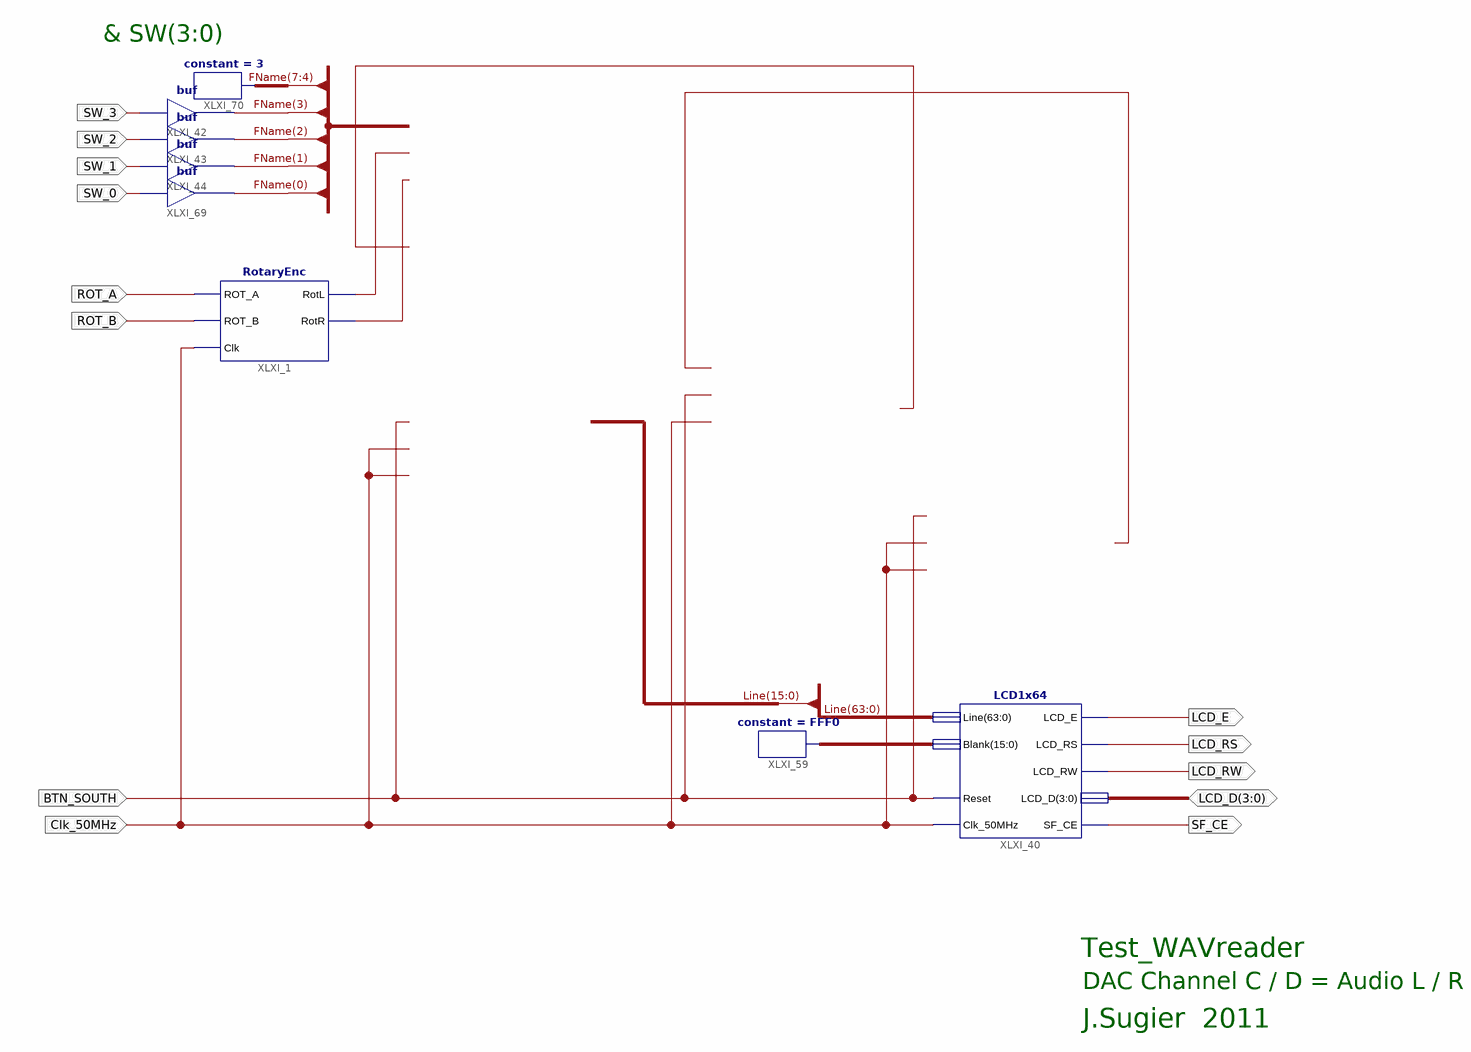
[diagram p0: schematic sheet 1]
// Xilinx ISE schematic Test_WAVreader.sch (spartan3e) as structural Verilog: 8 symbols, 13 ports
module Test_WAVreader (
  input  BTN_SOUTH,
  input  Clk_50MHz,
  input  SW_3,
  input  SW_2,
  input  SW_1,
  input  SW_0,
  input  ROT_A,
  input  ROT_B,
  inout  [3:0] LCD_D,
  output LCD_E,
  output LCD_RS,
  output LCD_RW,
  output SF_CE
);

  wire XLXN_326, XLXN_327;
  wire [7:0] FName;
  wire [15:0] XLXN_549;
  wire [63:0] Line;

  constant #(.CValue("FFF0")) XLXI_59 (.O(XLXN_549));
  LCD1x64 XLXI_40 (
    .Clk_50MHz(Clk_50MHz), .Reset(BTN_SOUTH), .Line(Line), .Blank(XLXN_549), .LCD_D(LCD_D), .LCD_E(LCD_E),
    .LCD_RW(LCD_RW), .LCD_RS(LCD_RS), .SF_CE(SF_CE));
  buf XLXI_42 (FName[3], SW_3);
  buf XLXI_43 (FName[2], SW_2);
  buf XLXI_44 (FName[1], SW_1);
  buf XLXI_69 (FName[0], SW_0);
  RotaryEnc XLXI_1 (.ROT_A(ROT_A), .ROT_B(ROT_B), .RotL(XLXN_326), .RotR(XLXN_327), .Clk(Clk_50MHz));
  constant #(.CValue("3")) XLXI_70 (.O(FName[7:4]));

  // Notes on the sheet:
  //   & SW(3:0)
  //   Test_WAVreader
  //   DAC Channel C / D = Audio L / R
  //   J.Sugier  2011
endmodule
